# EAGLE design TangPrimer_no_jtag (EAGLE 7.7.0)
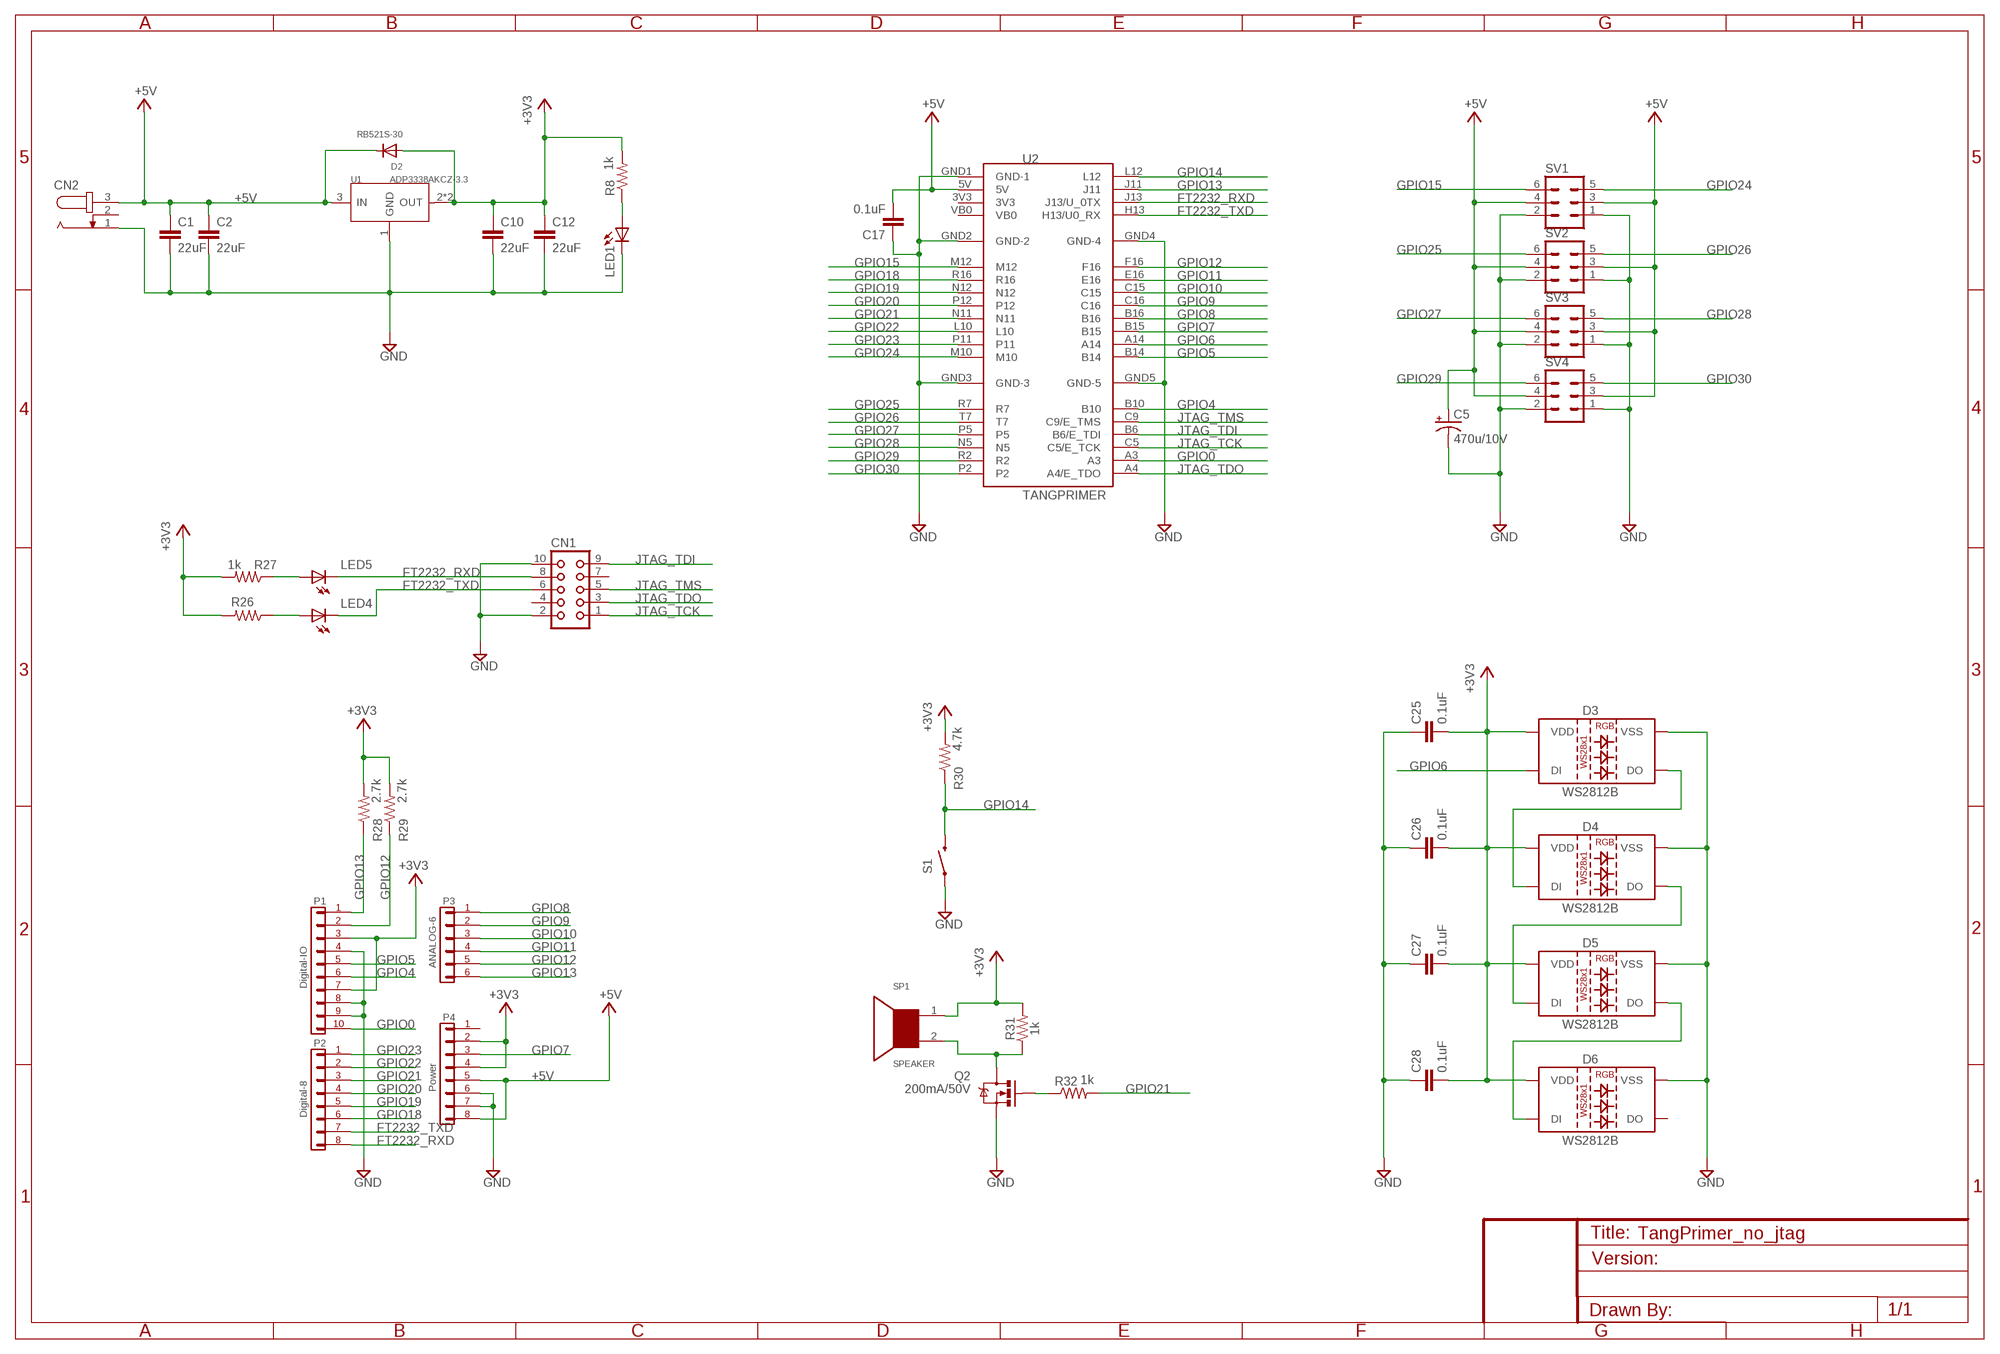
[diagram p0: schematic, sheet 1]

## Parts
C1  22uF  10UF-0603-6.3V-20%  [0603]
C2  22uF  10UF-0603-6.3V-20%  [0603]
C5  470u/10V  CPOL-USE2.5-7  [E2,5-7]
C10  22uF  10UF-0603-6.3V-20%  [0603]
C12  22uF  10UF-0603-6.3V-20%  [0603]
C17  0.1uF  0.1UF-0603-25V-5%  [0603]
C25  0.1uF  0.1UF-0603-25V-5%  [0603]
C26  0.1uF  0.1UF-0603-25V-5%  [0603]
C27  0.1uF  0.1UF-0603-25V-5%  [0603]
C28  0.1uF  0.1UF-0603-25V-5%  [0603]
CN1  CON10  [CON10]
CN2  JACK-PLUG0  [SPC4077]
D2  RB521S-30  DIODESOD-523  [SOD-523]
D3  WS2812B  WS2812_2020  [WS2812_2020]
D4  WS2812B  WS2812_2020  [WS2812_2020]
D5  WS2812B  WS2812_2020  [WS2812_2020]
D6  WS2812B  WS2812_2020  [WS2812_2020]
LED1  LEDCHIP-LED0805  [CHIP-LED0805]
LED4  LEDCHIP-LED0805  [CHIP-LED0805]
LED5  LEDCHIP-LED0805  [CHIP-LED0805]
Q2  200mA/50V  MOSFET-NCHANNELBSS138  [SOT23-3]
R8  1k  RESISTOR0603  [0603]
R26  1k  RESISTOR0603  [0603]
R27  1k  RESISTOR0603  [0603]
R28  2.7k  RESISTOR0603  [0603]
R29  2.7k  RESISTOR0603  [0603]
R30  4.7k  RESISTOR0603  [0603]
R31  1k  RESISTOR0603  [0603]
R32  1k  RESISTOR0603  [0603]
S1  SWITCH-MOMENTARY-2SMD-1101NE  [TACTILE-SWITCH-1101NE]
S2  TANGPRIMER_BASE  [TANGPRIMER_BASE]
SP1  SPEAKER  [SPEAKER]
SV1  MA03-2  [MA03-2]
SV2  MA03-2  [MA03-2]
SV3  MA03-2  [MA03-2]
SV4  MA03-2  [MA03-2]
U1  ADP3338AKCZ-3.3  PMIC-CJT1117-3.3(SOT223)  [SOT-223]
U2  TANGPRIMER  [TANGPRIMER]

## Nets
+3V3 [pow]: C10.1 C12.1 C25.2 C26.2 C27.2 C28.2 D2.A D3.4(VDD) D4.4(VDD) D5.4(VDD) D6.4(VDD) R8.2 R26.2 R27.2 R28.2 R29.2 R30.2 R31.2 S2.3V3-1 S2.3V3-2 S2.AREF S2.D11 SP1.1 U1.2(OUT) U1.TER(OUT)
+5V [pow]: C1.1 C2.1 C5.+ C17.2 CN2.3 D2.K(C) S2.5V S2.VIN SV1.3 SV1.4 SV2.3 SV2.4 SV3.3 SV3.4 SV4.3 SV4.4 U1.3(IN) U2.5V
FT2232_RXD: CN1.8 LED5.C S2.RXD(RX) U2.J13(J13/U_0TX)
FT2232_TXD: CN1.6 LED4.C S2.TXD(TX) U2.H13(H13/U0_RX)
GND [GND]: C1.2 C2.2 C5.- C10.2 C12.2 C17.1 C25.1 C26.1 C27.1 C28.1 CN1.2 CN1.10 CN2.1 D3.2(VSS) D4.2(VSS) D5.2(VSS) D6.2(VSS) LED1.C Q2.2(S) S1.1 S2.D9 S2.D10 S2.GND-1(GND1) S2.GND-2(GND2) S2.GND-3(GND3) SV1.1 SV1.2 SV2.1 SV2.2 SV3.1 SV3.2 SV4.1 SV4.2 U1.1(GND) U2.GND1(GND-1) U2.GND2(GND-2) U2.GND3(GND-3) U2.GND4(GND-4) U2.GND5(GND-5)
GPIO0: S2.D8 U2.A3
GPIO4: S2.D12 U2.B10
GPIO5: S2.D13 U2.B14
GPIO6: D3.3(DI) U2.A14
GPIO7: S2.RESET U2.B15
GPIO8: S2.A0 U2.B16
GPIO9: S2.A1 U2.C16
GPIO10: S2.A2 U2.C15
GPIO11: S2.A3 U2.E16
GPIO12: R29.1 S2.A4 S2.SDA U2.F16
GPIO13: R28.1 S2.A5 S2.SCL U2.J11
GPIO14: R30.1 S1.2 U2.L12
GPIO15: SV1.6 U2.M12
GPIO18: S2.D2 U2.R16
GPIO19: S2.D3 U2.N12
GPIO20: S2.D4 U2.P12
GPIO21: R32.2 S2.D5 U2.N11
GPIO22: S2.D6 U2.L10
GPIO23: S2.D7 U2.P11
GPIO24: SV1.5 U2.M10
GPIO25: SV2.6 U2.R7
GPIO26: SV2.5 U2.T7
GPIO27: SV3.6 U2.P5
GPIO28: SV3.5 U2.N5
GPIO29: SV4.6 U2.R2
GPIO30: SV4.5 U2.P2
JTAG_TCK: CN1.1 U2.C5(C5/E_TCK)
JTAG_TDI: CN1.9 U2.B6(B6/E_TDI)
JTAG_TDO: CN1.3 U2.A4(A4/E_TDO)
JTAG_TMS: CN1.5 U2.C9(C9/E_TMS)
N$3: Q2.3(D) R31.1 SP1.2
N$10: Q2.1(G) R32.1
N$12: LED1.A R8.1
N$22: LED4.A R26.1
N$24: LED5.A R27.1
N$29: D3.1(DO) D4.3(DI)
N$35: D4.1(DO) D5.3(DI)
N$37: D5.1(DO) D6.3(DI)
Unconnected: CN1.4 CN1.7 CN2.2 D6.1(DO) S2.RESERVED U2.3V3 U2.VB0

## Library data of the parts
C1 C2 C10 C12 = SparkFun-Capacitors:10UF: 10.0µF ceramic capacitors A capacitor is a passive two-terminal electrical component used to store electrical energy temporarily in an electric field.; PROD_ID: CAP-11015; VALUE: 10uF
C5 = resistor:CPOL-US: POLARIZED CAPACITOR, American symbol
C17 C25-C28 = SparkFun-Capacitors:0.1UF: 0.1µF ceramic capacitors A capacitor is a passive two-terminal electrical component used to store electrical energy temporarily in an electric field.; PROD_ID: CAP-08604
CN1 = con-harting:CON10: CONNECTOR; OC_FARNELL: unknown; OC_NEWARK: unknown
CN2 = con-jack:JACK-PLUG: DC POWER JACK Power Jack, DC, Right Angle, Through Hole, Rated 5A at 16VDC, PC Terminals Distributor: Farnell (www.Farnell.de) Drawing: 84N1161.pdf / 84N1162.pdf Manufacturer: SPC Technology (www.spctechnology.com) Type: SPC4077 / SPC 4078; OC_FARNELL: unknown; OC_NEWARK: unknown
D2 = adafruit:DIODE: Diode SMADIODE - SMA Surface Mount Package 20V 1A Schottky Diode Digikey: 641-1014-6-ND DO-1N4148 - Through Hole Small Current Diode SOD-123 20V 1 A (.5mV Vf) Schottky Diode - Digikey: MBRX120TPMSCT-ND SOD-323 10V 570mA (.38mV Vf, 3ns) Schottky Diode - Digikey: ZLLS410CT-ND SOD-523 30V 30mA Schottky Diode (RB751S-40TE61) - Digikey: RB751S-40TE61CT-ND SOT23-R/W - SOT23 Package (R = Solder Paste/Reflow Ovens, W = Hand-Soldering) BAT54Film 40V 300mA - Digikey: 497-7162-1-ND
D3-D6 = ws2812_2020:WS2812_2020: WS2812 2020 SMD addressable RGB LED 2x2mm SMD LED with built-in controller IC.; PROD_ID: DIO-12503
LED1 LED4 LED5 = adafruit:LED: LED OSRAM: - CHIPLED LG R971, LG N971, LY N971, LG Q971, LY Q971, LO R971, LY R971 LH N974, LH R974 LS Q976, LO Q976, LY Q976 LO Q996 - Hyper CHIPLED LW Q18S LB Q993, LB Q99A, LB R99A - SideLED LS A670, LO A670, LY A670, LG A670, LP A670 LB A673, LV A673, LT A673, LW A673 LH A674 LY A675 LS A676, LA A676, LO A676, LY A676, LW A676 LS A679, LY A679, LG A679 - Hyper Micro SIDELED® LS Y876, LA Y876, LO Y876, LY Y876 LT Y87S - SmartLED LW L88C, LW L88S LB L89C, LB L89S, LG L890 LS L89K, LO L89K, LY L89K LS L896, LA L896, LO L896, LY L896 - TOPLED LS T670, LO T670, LY T670, LG T670, LP T670 LSG T670, LSP T670, LSY T670, LOP T670, LYG T670 LG T671, LOG T671, LSG T671 LB T673, LV T673, LT T673, LW T673 LH T674 LS T676, LA T676, LO T676, LY T676, LB T676, LH T676, LSB T676, LW T676 LB T67C, LV T67C, LT T67C, LS T67K, LO T67K, LY T67K, LW E67C LS E67B, LA E67B, LO E67B, LY E67B, LB E67C, LV E67C, LT E67C LW T67C LS T679, LY T679, LG T679 LS T770, LO T770, LY T770, LG T770, LP T770 LB T773, LV T773, LT T773, LW T773 LH T774 LS E675, LA E675, LY E675, LS T675 LS T776, LA T776, LO T776, LY T776, LB T776 LHGB T686 LT T68C, LB T68C - Hyper Mini TOPLED® LB M676 - Mini TOPLED Santana® LG M470 LS M47K, LO M47K, LY M47K Source: http://www.osram.convergy.de/
Q2 = SparkFun-DiscreteSemi:MOSFET-NCHANNEL: Common NMOSFET Parts MFG P/N Store ID Prod ID FDD8780 TRANS-09984 SI7820DN TRANS-11055 FDS6630A IC-08089 2N7002PW TRANS-11151 FQP30N06L COM-10213 TRANS-10060 BSS123LT1G TRANS-08345 BSS138 TRANS-00830 BS170 2N7000; PROD_ID: TRANS-00830
R8 R26-R32 = SparkFun-Resistors:RESISTOR: Generic Resistor Package
S1 = SparkFun-Electromechanical:SWITCH-MOMENTARY-2: Various NO switches- pushbuttons, reed, etc; PROD_ID: SWCH-00815
S2 = suna_lib:TANGPRIMER_BASE
SP1 = cq:SPEAKER
SV1-SV4 = con-lstb:MA03-2: PIN HEADER; OC_FARNELL: unknown; OC_NEWARK: unknown
U1 = Seeed-OPL-ic:PMIC-CJT1117-3.3(SOT223): 310030097; MPN: CJT1117-3.3; VALUE: CJT1117-3.3-SOT223
U2 = suna_lib:TANGPRIMER

## Net classes
1 pow: width 0.406 mm
2 GND: width 0.61 mm

## Board
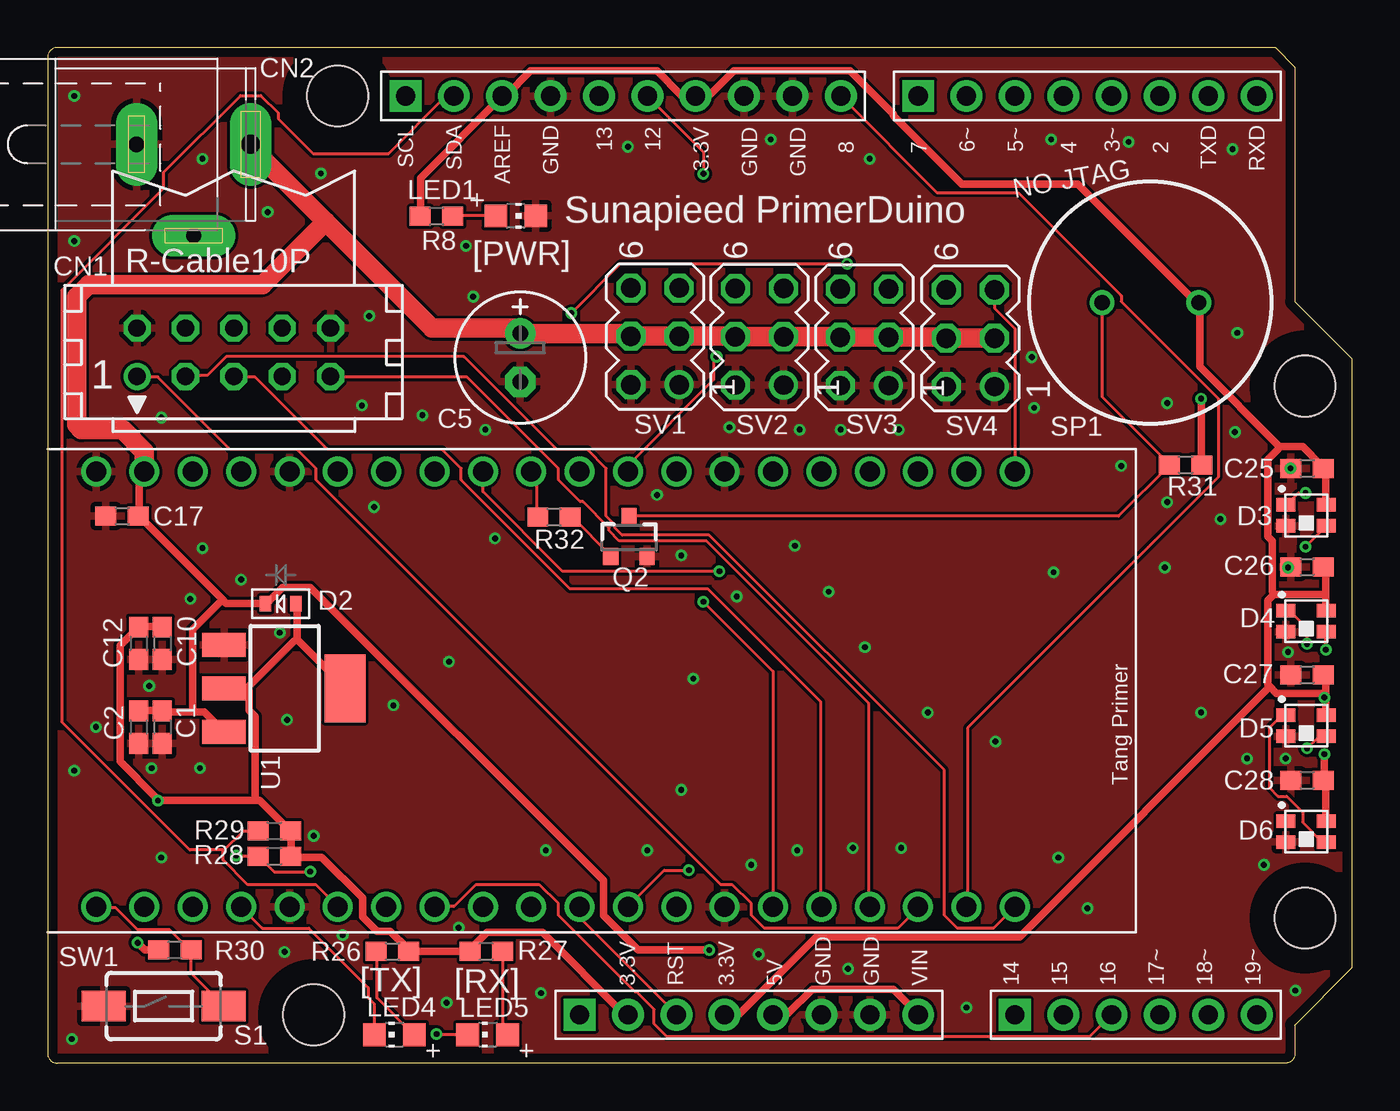
[diagram p1: board, top side]
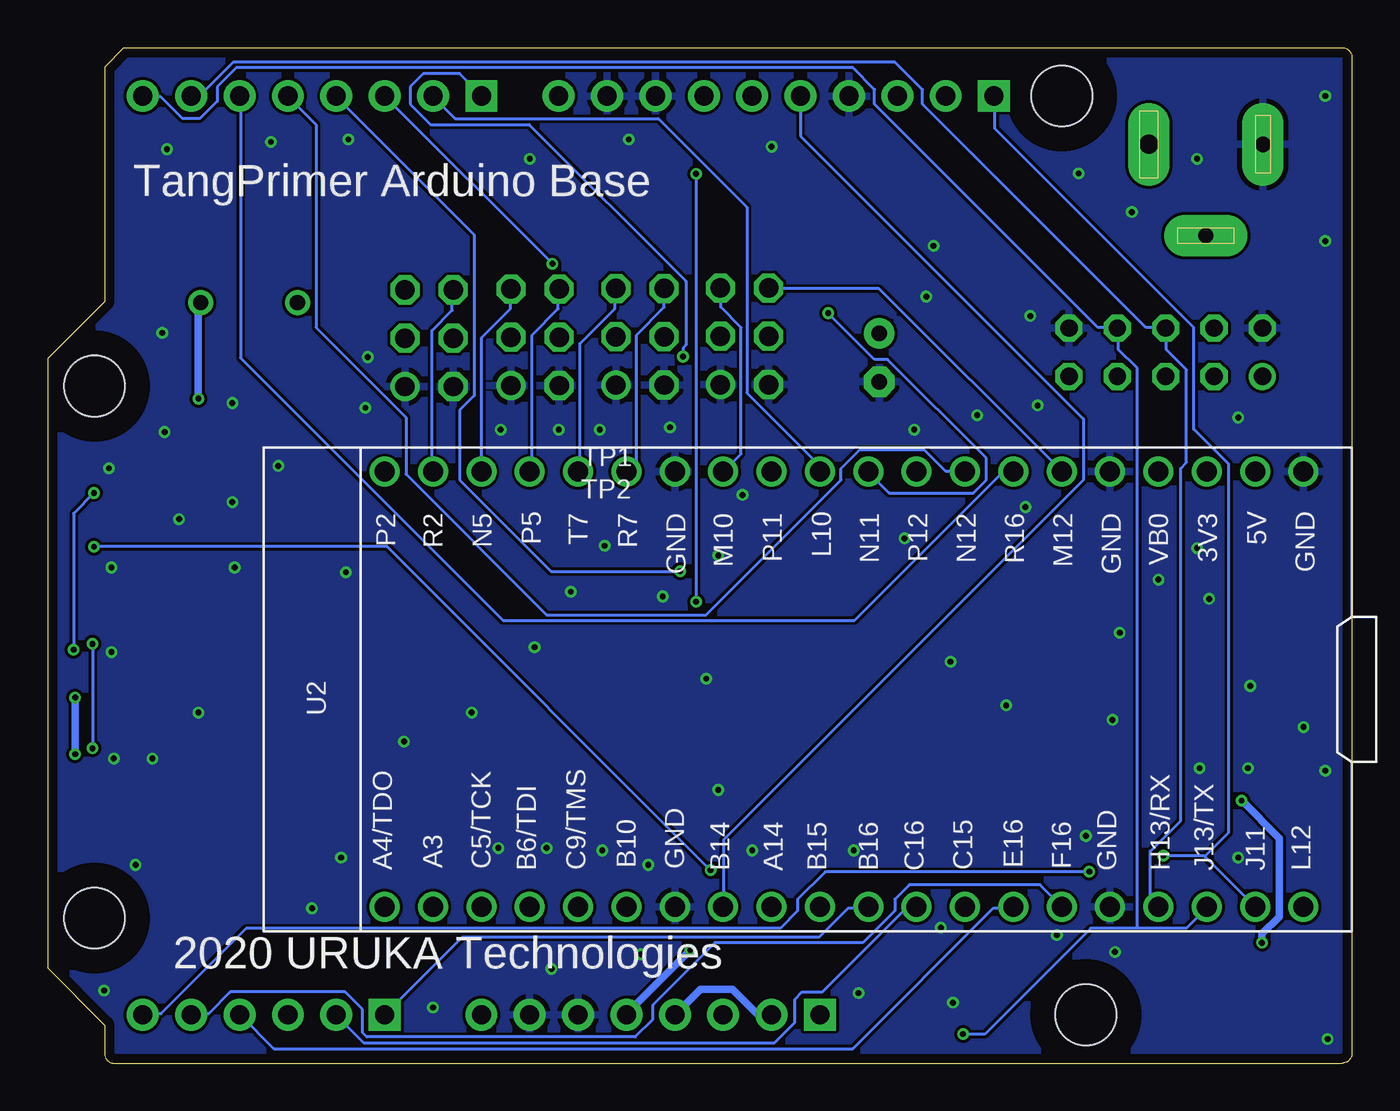
[diagram p2: board, bottom side, seen from below]

Size 68.5 x 53.34 mm. Coordinates in mm from the lower left corner, seen from the top.
Copper layers (1*16): Top 0.035mm / dielectric 1.53mm / Bottom 0.035mm
Design rules "seeed_pban_5mil": minimum track width 6mil, minimum drill 12mil, track to track 6mil, track to pad 0.229mm, pad to pad 6mil, via to via 6mil, smd to smd 5mil, copper to edge 0.5mm, drill to drill 0.5mm, minimum pad ring 10mil, minimum via ring 6mil, stop-mask expansion 4mil, vias tented up to drill 25mil, thermal gap 10mil

### Footprints (pad centres in the part's own frame; a part is rotated, then mirrored left to right if it is on the bottom)
0603 = smd 1.1 x 1: 1 -0.85,0; 2 0.85,0
E2,5-7 = drill 0.813 pad 1.6: + -1.27,0 | drill 0.813 pad 1.6 octagon: - 1.27,0
CON10 = drill 0.914: 1 -5.08,-1.27 | drill 0.914 octagon: 2 -5.08,1.27; 3 -2.54,-1.27; 4 -2.54,1.27; 5 0,-1.27; 6 0,1.27; 7 2.54,-1.27; 8 2.54,1.27; 9 5.08,-1.27; 10 5.08,1.27
SPC4077 = drill 0.8 pad 2.184 long: 1 -3,0; 2 0,-4.8 | drill 1 pad 2.184 long: 3 3,0
SOD-523 = smd 0.8 x 0.6: A 0,-0.8; K 0,0.8
WS2812_2020 = smd 1 x 0.7: 1 0.565,-0.9; 2 0.565,0.2; 3 -1.565,0.2; 4 -1.565,-0.9
CHIP-LED0805 = smd 1.2 x 1.2: A 0,-1.05; C 0,1.05
SOT23-3 = smd 0.8 x 0.9: 1 -0.95,-1; 2 0.95,-1; 3 0,1.1
TACTILE-SWITCH-1101NE = smd 2.3 x 1.6: 1 -3.15,0; 2 3.15,0
TANGPRIMER_BASE = drill 1 pad 1.676: 3V3-1 30.48,2.54; 3V3-2 35.56,2.54; 5V 38.1,2.54; A1 53.34,2.54; A2 55.88,2.54; A3 58.42,2.54; A4 60.96,2.54; A5 63.5,2.54; AREF 23.876,50.8; D2 58.42,50.8; D3 55.88,50.8; D4 53.34,50.8; D5 50.8,50.8; D6 48.26,50.8; D8 41.656,50.8; D9 39.116,50.8; D10 36.576,50.8; D11 34.036,50.8; D12 31.496,50.8; D13 28.956,50.8; GND-1 40.64,2.54; GND-2 43.18,2.54; GND-3 26.416,50.8; RESET 33.02,2.54; RXD 63.5,50.8; SDA 21.336,50.8; TXD 60.96,50.8; VIN 45.72,2.54 | drill 1 pad 1.676 square: A0 50.8,2.54; D7 45.72,50.8; RESERVED 27.94,2.54; SCL 18.796,50.8 | hole 3.2: 66.04,35.56; 66.04,7.62; 13.97,2.54; 15.24,50.8
SPEAKER = drill 0.8: 1 -2.54,0; 2 2.54,0
MA03-2 = drill 1.016: 1 -2.54,-1.27 | drill 1.016 octagon: 2 -2.54,1.27; 3 0,-1.27; 4 0,1.27; 5 2.54,-1.27; 6 2.54,1.27
SOT-223 = smd 1.27 x 2.286: 1 -2.286,-3.175; 2 0,-3.175; 3 2.286,-3.175 | smd 3.556 x 2.159: TER 0,3.175
TANGPRIMER = drill 1.05: 3V3 -11.43,19.05; 5V -11.43,21.59; A3 11.43,-21.59; A4 11.43,-24.13; A14 11.43,-3.81; B6 11.43,-16.51; B10 11.43,-11.43; B14 11.43,-6.35; B15 11.43,-1.27; B16 11.43,1.27; C5 11.43,-19.05; C9 11.43,-13.97; C15 11.43,6.35; C16 11.43,3.81; E16 11.43,8.89; F16 11.43,11.43; GND1 -11.43,24.13; GND2 -11.43,13.97; GND3 -11.43,-8.89; GND4 11.43,13.97; GND5 11.43,-8.89; H13 11.43,16.51; J11 11.43,21.59; J13 11.43,19.05; L10 -11.43,-1.27; L12 11.43,24.13; M10 -11.43,-6.35; M12 -11.43,11.43; N5 -11.43,-19.05; N11 -11.43,1.27; N12 -11.43,6.35; P2 -11.43,-24.13; P5 -11.43,-16.51; P11 -11.43,-3.81; P12 -11.43,3.81; R2 -11.43,-21.59; R7 -11.43,-11.43; R16 -11.43,8.89; T7 -11.43,-13.97; VB0 -11.43,16.51

### Placement (x,y rotation side)
C1  6.02,17.65 270 top
C2  4.78,17.65 270 top
C5  24.82,37.06 270 top
C10  6.02,22.05 270 top
C12  4.78,22.05 270 top
C17  3.91,28.73 0 top
C25  66.15,31.24 0 top
C26  66.15,26.06 0 top
C27  66.15,20.4 0 top
C28  66.15,14.86 0 top
CN1  9.78,37.34 0 top
CN2  7.67,48.26 0 top
D2  12.24,24.13 90 top
D3  65.6,28.42 180 top
D4  65.6,22.86 180 top
D5  65.6,17.37 180 top
D6  65.6,11.81 180 top
LED1  24.59,44.5 270 top
LED4  18.21,1.5 90 top
LED5  23.11,1.5 90 top
Q2  30.53,27.61 0 top
R8  20.42,44.48 180 top
R26  18.11,5.87 0 top
R27  23.04,5.87 180 top
R28  11.91,10.87 0 top
R29  11.91,12.19 0 top
R30  6.68,5.94 180 top
R31  59.77,31.42 0 top
R32  26.59,28.68 180 top
S1  6.1,3 0 top
S2  0,0 0 top
SP1  57.92,39.95 180 top
SV1  31.9,38.18 90 top
SV2  37.39,38.15 90 top
SV3  42.9,38.13 90 top
SV4  48.46,38.07 90 top
U1  12.45,19.68 270 top
U2  26.67,19.63 270 bottom

### Tracks (layer width: path | path; a pad name or v marks a point on that pad's centre or on a via)
+3V3  (via drill 0.3)
  Top 0.406: 13.11,22.25 13.11,24.08 D2.A | 13.11,22.25 15.62,19.74 U1.TER | 10.52,19.74 9.3,19.74 U1.2 | 10.52,19.74 12.95,22.17 13.11,22.25 | C10.1 6.02,22.94 4.8,22.94 C12.1 4.65,22.78 3.81,21.95 3.81,15.85 5.71,13.95 v5.79,13.79 10.9,13.79 | R30.2 5.11,5.94 v4.72,6.33 | 10.9,13.79 11.12,13.79 12.72,12.19 R29.2 12.8,12.04 12.8,10.9 R28.2 12.95,10.82 14.4,10.82 16.54,8.69 16.54,7.7 17.3,6.93 17.98,6.93 18.9,6.02 R26.2 R27.2 22.25,6.02 23.09,6.86 25.98,6.86 30.25,2.59 30.48,2.59 S2.3V3-1 | 10.9,13.79 10.9,18.21 10.59,18.52 10.59,19.58 10.52,19.74 | R8.2 19.58,44.5 19.58,46.48 23.85,50.75 S2.AREF 24.08,50.83 25.38,52.12 32,52.12 33.3,50.83 33.98,50.83 S2.D11 34.21,50.9 34.82,50.9 36.04,52.12 42.14,52.12 44.42,49.84 44.42,49.76 48.01,46.18 54.1,46.18 60.27,40.01 SP1.1 60.5,39.93 60.5,36.58 64.69,32.38 | D6.4 67.13,12.72 67.13,14.78 67.06,14.86 C28.2 67.06,15.01 v67.06,16.23 | 67.13,19.43 67.13,20.27 67.06,20.34 C27.2 | 67.13,19.43 67.13,19.2 | 67.13,19.2 67.13,18.29 D5.4 | 67.13,24.61 67.13,25.98 67.06,26.06 C26.2 | 67.13,24.61 67.13,23.77 D4.4 | 67.13,19.43 64.54,19.43 64.2,19.77 | 64.2,19.77 64.08,19.89 64.08,24.31 64.39,24.61 | 67.13,24.61 64.39,24.61 | v67.06,19.2 67.13,19.2 | D3.4 67.13,29.34 67.13,31.17 67.06,31.24 C25.2 66.9,31.39 65.91,32.38 64.69,32.38 | v60.58,34.9 60.58,31.47 R31.2 | 64.39,24.61 64.31,24.77 64.31,27.43 64.08,27.66 64.08,31.7 64.62,32.23 64.69,32.38 | 64.2,19.77 51.05,6.63 40.39,6.63 36.35,2.59 35.59,2.59 S2.3V3-2
  Bottom 0.406: S2.3V3-2 34.21,3.89 32.54,3.89 31.24,2.59 30.48,2.59 S2.3V3-1 | v4.72,6.33 4.72,6.78 3.81,7.7 3.81,11.81 v5.79,13.79 | v67.06,19.2 v67.06,16.23 | v60.58,34.9 60.58,39.85 60.5,39.93 SP1.1
+5V  (via drill 0.3)
  Top 0.406: S2.5V 38.1,2.59 38.86,2.59 40.16,3.89 44.42,3.89 45.72,2.59 S2.VIN | C2.1 4.8,18.52 6.02,18.52 C1.1 6.17,18.44 7.62,18.44 | 7.62,18.44 8.23,18.44 U1.3 | 9.18,24.35 4.8,28.73 C17.2 4.8,28.88 4.8,30.63 U2.5V | 9.18,24.35 9.37,24.16 11.43,24.16 D2.K 11.58,24.23 12.34,24.99 13.79,24.99 29.18,9.6 29.18,7.77 31.01,5.94 v34.75,5.94 | 7.62,18.44 7.62,22.78 9.18,24.35
  Top 1.016: CN2.3 10.67,48.13 14.61,44.2 | 14.61,44.2 20.19,38.61 24.54,38.61 C5.+ 30.48,38.33 SV1.4 SV1.3 36.09,38.18 SV2.4 SV2.3 41.6,38.15 SV3.4 SV3.3 47.14,38.12 SV4.4 SV4.3 | U2.5V 5.08,32.13 3.94,33.27 1.78,33.27 1.52,33.53 1.52,40.26 2.16,40.89 11.3,40.89 14.61,44.2
  Bottom 0.406: v34.75,5.94 38.1,2.59 S2.5V
FT2232_RXD  (via drill 0.3)
  Top 0.152: v20.42,1.52 22.02,1.52 LED5.C
  Bottom 0.152: v20.42,1.52 19.28,1.52 13.72,7.09 11.28,7.09 | 11.28,7.09 8.69,7.09 7.62,8.15 U2.J13 | 11.28,7.09 11.28,36.5 12.27,37.49 12.27,38.56 CN1.8 12.34,38.63 13.34,38.63 25.07,50.37 25.07,51.13 26.21,52.27 58.6,52.27 59.59,51.28 59.59,50.52 60.5,49.61 61.42,49.61 62.56,50.75 63.48,50.75 S2.RXD
FT2232_TXD
  Top 0.152: U2.H13 11.28,7.09 13.72,7.09 16.84,3.96 16.84,3.43 17.14,3.12 17.14,1.52 LED4.C
  Bottom 0.152: U2.H13 10.21,8.23 10.59,8.61 10.59,11.12 8.99,12.72 8.99,31.24 8.69,31.55 8.69,36.42 9.75,37.49 9.75,38.56 CN1.6 9.83,38.63 10.82,38.63 22.55,50.37 22.55,51.13 24,52.58 58.75,52.58 60.5,50.83 60.96,50.83 S2.TXD
GND  (via drill 0.3)
  other vias: 1.4,50.8 14.35,46.74 11.56,44.7 30.48,48.13 37.97,48.51 43.18,47.5 52.7,48.51 56.77,48.39 62.23,48.01 62.48,38.35 58.8,34.67 61.59,28.57 58.67,26.04 52.83,25.78 42.93,21.84 33.91,20.19 49.78,16.89 53.09,10.79 54.61,8.13 65.53,3.81 62.99,16 36.96,10.41 33.27,14.35 31.5,11.18 48.26,2.92 25.91,3.68 20.95,3.17 26.16,11.18 13.97,11.94 12.45,5.84 5.97,10.79 1.4,15.37 2.54,17.65 8,15.49 5.46,15.49 1.27,1.27 12.57,18.03 12.19,22.61 7.49,24.38 10.16,25.4 8.13,27.05 5.97,33.91 16.89,39.24 1.4,43.18 8.13,47.5 21.97,42.93 22.35,40.26 32,29.84 33.27,26.67 41.02,24.77 39.24,27.18 56.39,31.37 58.8,29.46 62.36,33.15 18.16,18.8 21.08,21.08 17.14,29.21 16.51,34.54 19.68,34.04 22.99,33.27 23.5,27.56 39.37,11.18 42.29,11.3 44.83,11.3 36.2,24.51 65.02,16 65.15,21.59 65.15,26.04 65.28,31.24 60.58,18.41 46.23,18.41 35.81,33.4 39.5,33.27 41.66,33.27 44.7,33.27 51.82,34.42 51.69,37.08 5.33,19.81 15.49,6.73 21.59,7.11 37.34,5.71 42.04,4.95 63.88,10.41
  pour Bottom: 0,53.34 68.58,53.34 68.58,0 0,0
  pour Top: 0,53.34 68.58,53.34 68.58,0 0,0
GPIO0
  Top 0.152: U2.A3 48.31,8.23 48.31,17.6 61.49,30.79 61.49,34.9 56.39,40.01 56.39,40.31 50.98,45.72 46.71,45.72 41.68,50.75 S2.D8
GPIO4  (via drill 0.3)
  Top 0.152: U2.B10 38.1,20.57 v34.44,24.23 | v34.44,46.71 34.44,47.85 S2.D12
  Bottom 0.152: v34.44,46.71 v34.44,24.23
GPIO5
  Bottom 0.152: S2.D13 28.96,48.69 14.1,33.83 14.1,30.63 32.99,11.73 32.99,8.23 U2.B14
GPIO6  (via drill 0.3)
  Top 0.152: v66.06,27.13 67.13,28.19 D3.3 | v33.68,10.13 32.38,10.13 30.48,8.23 U2.A14
  Bottom 0.152: v66.06,27.13 50.67,27.13 v33.68,10.13
GPIO7
  Top 0.152: U2.B15 27.96,8.15 27.96,7.62 32.99,2.59 S2.RESET
GPIO8
  Bottom 0.152: S2.A0 46.71,6.63 27.96,6.63 26.44,8.15 25.45,8.15 U2.B16
GPIO9
  Bottom 0.152: U2.C16 22.86,8.15 23.39,8.15 27.81,3.73 28.88,3.73 29.26,3.35 29.26,2.13 30.33,1.07 51.89,1.07 53.34,2.52 S2.A1
GPIO10
  Top 0.152: S2.A2 54.71,1.37 32.54,1.37 31.85,2.06 31.85,2.82 30.94,3.73 30.86,3.73 26.82,7.77 26.82,8.38 25.83,9.37 22.48,9.37 21.34,8.23 20.34,8.23 U2.C15
GPIO11
  Bottom 0.152: U2.E16 17.83,8.15 18.82,8.15 26.21,0.76 56.62,0.76 58.37,2.52 S2.A3
GPIO12
  Top 0.152: R29.1 10.29,12.19 9.26,11.16 | 9.26,11.16 9.22,11.12 9.22,10.67 10.52,9.37 14.1,9.37 15.24,8.23 U2.F16 | S2.SDA 21.34,50.75 20.88,50.75 17.91,47.78 13.95,47.78 12.12,49.61 12.12,49.91 11.2,50.83 10.13,50.83 6.1,46.79 6.1,45.95 0.76,40.62 0.76,17.91 7.47,11.2 9.22,11.2 9.26,11.16
  Bottom 0.152: S2.A4 60.96,2.59 60.05,2.59 58.9,3.73 52.88,3.73 51.97,2.82 51.97,1.6 51.74,1.37 37.64,1.37 36.73,2.29 36.73,3.05 33.45,6.33 25.68,6.33 24,8 24,8.61 23.24,9.37 16.38,9.37 15.24,8.23 U2.F16
GPIO13  (via drill 0.3)
  Top 0.152: v9.91,10.9 11.05,10.9 R28.1 11.12,10.82 11.89,10.06 v13.79,10.06
  Bottom 0.152: v9.91,10.9 7.77,10.9 7.73,10.86 | U2.J11 7.73,10.86 | v13.79,10.06 27.66,10.06 29.11,8.61 29.11,8 30.02,7.09 58.06,7.09 62.56,2.59 63.48,2.59 S2.A5 | 7.73,10.86 6.48,12.12 6.48,31.47 8.31,33.3 8.31,38.63 18.75,49.07 18.75,50.75 S2.SCL
GPIO14
  Top 0.152: S1.2 9.22,3.05 7.54,4.72 7.54,5.94 R30.1 7.47,5.94 6.4,7.01 4.72,7.01 3.58,8.15 2.59,8.15 U2.L12
GPIO15
  Bottom 0.152: SV1.6 30.63,40.69 24.84,40.69 15.24,31.09 U2.M12
GPIO18
  Bottom 0.152: U2.R16 17.83,31.01 18.36,31.01 26.14,23.24 44.58,23.24 58.37,37.03 58.37,50.75 S2.D2
GPIO19
  Bottom 0.152: U2.N12 20.34,31.09 21.34,31.09 22.48,32.23 25.83,32.23 26.82,31.24 26.82,30.63 33.91,23.55 42.29,23.55 49.68,30.94 49.68,33.91 54.41,38.63 54.41,49.3 55.85,50.75 S2.D3
GPIO20  (via drill 0.3)
  Top 0.152: U2.P12 22.86,30.02 27.05,25.83 v35.28,25.83
  Bottom 0.152: v35.28,25.83 42.06,25.83 46.86,30.63 46.86,34.29 46.1,35.05 46.1,43.51 53.34,50.75 S2.D4
GPIO21  (via drill 0.3)
  Top 0.152: U2.N11 25.68,30.79 25.68,28.73 R32.2 | v41.99,41.99 30.1,41.99 v27.51,39.4
  Bottom 0.152: v41.99,41.99 S2.D5 | v27.51,39.4 25.07,36.96 24.38,36.96 19.2,31.77 19.2,30.63 19.89,29.95 24.31,29.95 25.38,31.01 U2.N11
GPIO22
  Bottom 0.152: U2.L10 27.96,31.09 27.96,31.39 31.77,35.2 31.77,44.96 36.42,49.61 47.09,49.61 48.23,50.75 S2.D6
GPIO23  (via drill 0.3)
  Top 0.152: U2.P11 30.48,31.39 34.98,35.89 34.98,36.96 v35.13,37.11
  Bottom 0.152: v35.13,37.11 35.13,37.57 34.98,37.72 34.98,41.07 43.2,49.3 48.39,49.3 49.45,50.37 49.45,51.28 48.77,51.97 46.86,51.97 45.72,50.83 S2.D7
GPIO24
  Bottom 0.152: U2.M10 32.08,32 32.08,38.63 33.15,39.7 33.15,40.69 SV1.5
GPIO25
  Bottom 0.152: SV2.6 36.12,39.7 37.57,38.25 37.57,31.62 38.1,31.09 U2.R7
GPIO26
  Bottom 0.152: U2.T7 40.54,31.17 40.54,37.8 38.71,39.62 38.71,40.69 SV2.5
GPIO27
  Bottom 0.152: SV3.6 41.68,40.62 41.68,39.62 43.05,38.25 43.05,31.17 43.13,31.09 U2.P5
GPIO28
  Bottom 0.152: U2.N5 45.72,38.1 44.2,39.62 44.2,40.62 SV3.5
GPIO29
  Bottom 0.152: SV4.6 47.24,40.62 47.24,39.55 48.31,38.48 48.31,31.09 U2.R2
GPIO30
  Top 0.152: SV4.5 49.76,40.62 49.76,39.62 50.83,38.56 50.83,31.09 U2.P2
JTAG_TCK
  Top 0.152: CN1.1 4.72,36.04 5.79,36.04 9.6,32.23 13.11,32.23 14.1,31.24 14.1,30.63 35.36,9.37 35.97,9.37 36.96,8.38 36.96,7.77 37.64,7.09 44.65,7.09 45.72,8.15 U2.C5
JTAG_TDI
  Top 0.152: CN1.9 14.86,36.04 22.02,36.04 26.82,31.24 26.82,30.63 27.96,29.49 28.12,29.49 29.49,28.12 29.49,27.96 30.02,27.43 34.59,27.43 43.13,18.9 43.13,8.23 U2.B6
JTAG_TDO
  Top 0.152: U2.A4 49.68,7.09 47.78,7.09 47.09,7.77 47.09,15.39 34.75,27.74 30.18,27.74 29.79,28.12 29.79,28.27 29.34,28.73 29.34,31.24 28.35,32.23 26.75,32.23 21.87,37.11 9.37,37.11 8.38,36.12 7.24,36.12 CN1.3
JTAG_TMS
  Top 0.152: CN1.5 9.83,36.04 10.9,36.04 14.71,32.23 20.73,32.23 21.72,31.24 21.72,30.63 27.43,24.92 34.67,24.92 40.62,18.97 40.62,8.23 U2.C9
N$3
  Top 0.152: Q2.3 30.56,28.73 56.24,28.73 58.9,31.39 R31.1 58.9,31.47 55.4,34.98 55.4,39.93 SP1.2
N$10
  Top 0.152: Q2.1 29.57,26.67 27.51,28.73 R32.1
N$12
  Top 0.152: LED1.A 21.34,44.5 R8.1
N$22
  Top 0.152: R26.1 17.3,5.87 17.3,3.43 19.2,1.52 LED4.A
N$24
  Top 0.152: R27.1 23.93,5.87 23.93,1.75 24.16,1.52 LED5.A
N$29  (via drill 0.3)
  Top 0.152: v67.13,21.72 67.13,22.63 D4.3 | v66.06,29.95 65.68,29.95 65.08,29.34 D3.1
  Bottom 0.152: v67.13,21.72 67.13,28.88 v66.06,29.95
N$35  (via drill 0.3)
  Top 0.152: v66.14,16.54 66.75,17.14 67.13,17.14 D5.3 | v66.14,22.02 66.14,22.86 65.3,23.7 65.08,23.7 D4.1
  Bottom 0.152: v66.14,22.02 v66.14,16.54
N$37
  Top 0.152: D6.3 67.13,11.66 66.9,11.66 65.91,12.65 65.91,13.18 65.08,14.02 64.62,14.02 64.16,14.48 64.16,17.6 64.77,18.21 65,18.21 D5.1

### Text on the board
tPlace: 13 | 12 | 3.3V | GND | GND | 6~ | 5~ | 3~ | 8 | 7 | 4 | 2 | NO JTAG | Sunapieed PrimerDuino | [PWR] | Tang Primer | SW1 | [TX] | [RX] | 14 | 15 | 16 | 17~ | 18~ | 19~
bPlace: TangPrimer Arduino Base | TP1 | TP2 | 2020 URUKA Technologies